# Altium schematic sheet STM8S103F3P6最小系统原理图.SchDoc
size A4
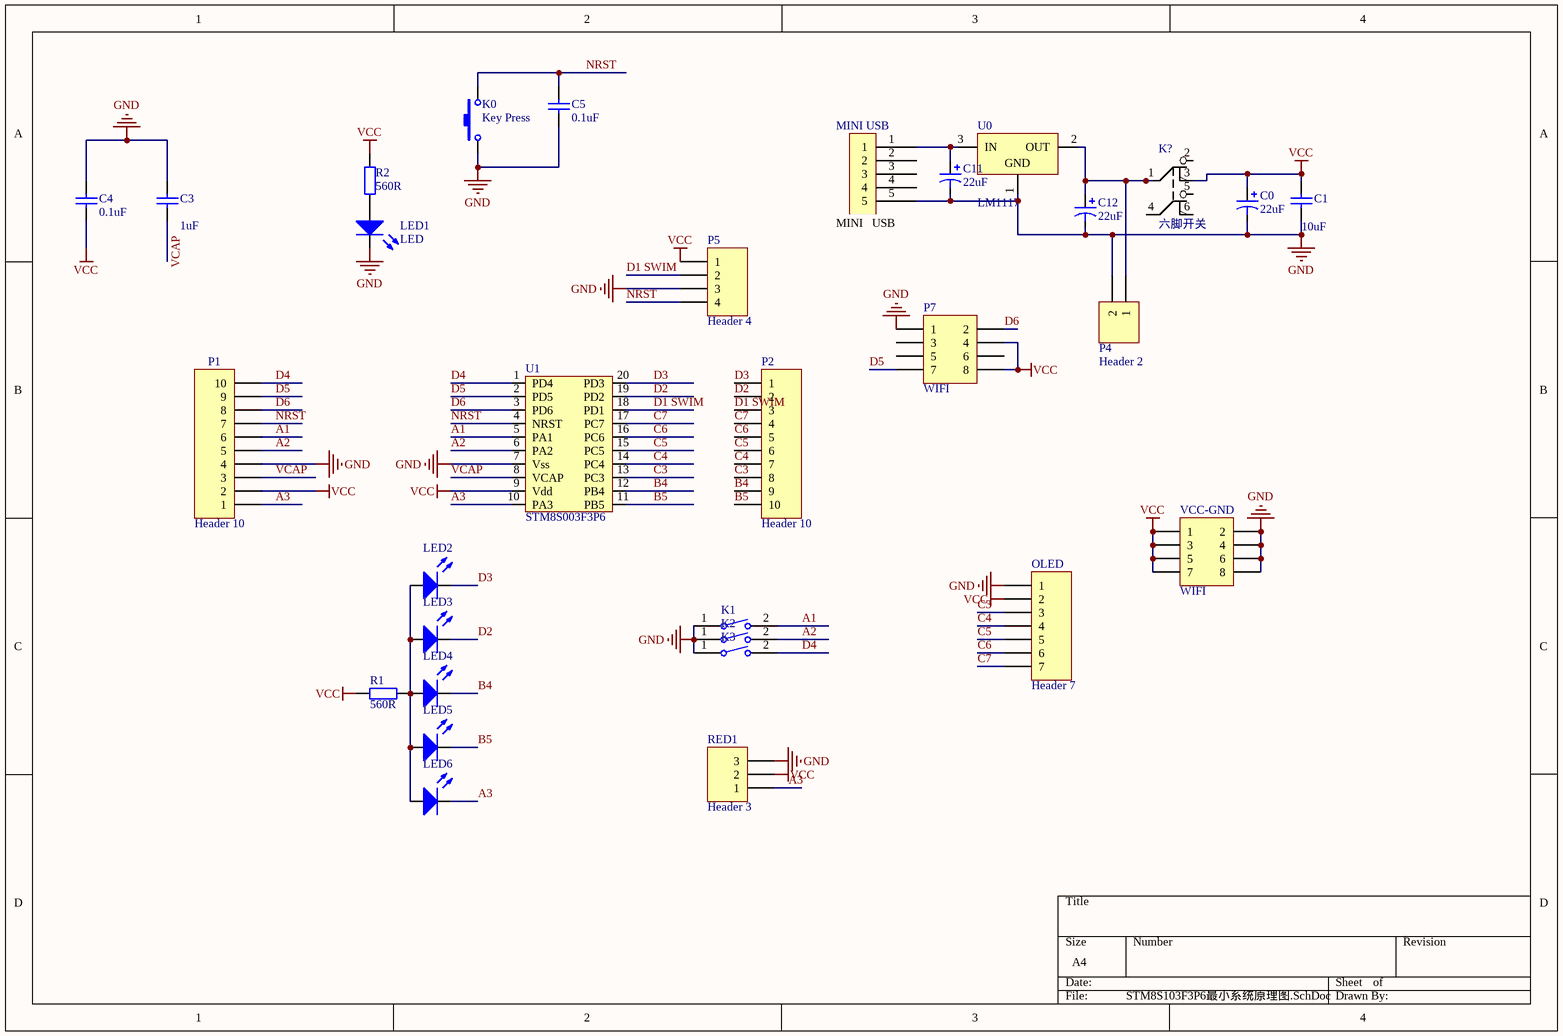
[diagram p0: STM8S103F3P6最小系统原理图.SchDoc]

## Parts
C0  value 22uF  [Pol Cap(220uF)]  (hidden comment: 100uF)
C1  value 10uF  [0805]
C3  value 1uF  [0805]
C4  0.1uF  [0805]
C5  0.1uF  [0805]
C11  value 22uF  [pol cap(10uF)]  (hidden comment: pol cap)
C12  value 22uF  [pol cap(10uF)]  (hidden comment: pol cap)
K0  Key Press  [K_Press]
K1  (no value)  [按键]
K2  (no value)  [按键]
K3  (no value)  [按键]
K?  六脚开关  [按钮开关]
LED1  LED  [LED(0805)]
LED2  (no value)  [LED(0805)]
LED3  (no value)  [LED(0805)]
LED4  (no value)  [LED(0805)]
LED5  (no value)  [LED(0805)]
LED6  (no value)  [LED(0805)]
MINI_USB  (no value)  [MICRO-USB]
OLED  Header 7  [HDR1X7]
P1  Header 10  [HDR1X10]
P2  Header 10  [HDR1X10]
P4  Header 2  [HDR1X2]
P5  Header 4  [HDR1X4]
P7  WIFI  [HDR2X4]
R1  560R  [0805]
R2  560R  [0805]
RED1  Header 3  [HDR1X3]
U0  LM1117  [AMS117]
U1  STM8S003F3P6  [SOP20 - duplicate]
VCC-GND  WIFI  [HDR2X4]

## Nets
GND: C0.2 C1.1 C3.1 C4.1 C5.1 C11.2 C12.2 K0.1 K1.1 K2.1 K3.1 LED1.2(K) MINI_USB.5 OLED.1 P1.4 P4.2 P5.3 P7.1 RED1.3 U0.1(GND) U1.7(Vss) VCC-GND.2 VCC-GND.4 VCC-GND.6 VCC-GND.8
VCC: C0.1 C1.2 C4.2 K?.3 OLED.2 P1.2 P5.1 P7.4 P7.8 R1.1 R2.2 RED1.2 U1.9(Vdd) VCC-GND.1 VCC-GND.3 VCC-GND.5 VCC-GND.7
A1: K1.2 P1.6 U1.5(PA1)
A2: K2.2 P1.5 U1.6(PA2)
A3: LED6.2(K) P1.1 RED1.1 U1.10(PA3)
B4: LED4.2(K) P2.9 U1.12(PB4)
B5: LED5.2(K) P2.10 U1.11(PB5)
C3: OLED.3 P2.8 U1.13(PC3)
C4: OLED.4 P2.7 U1.14(PC4)
C5: OLED.5 P2.6 U1.15(PC5)
C6: OLED.6 P2.5 U1.16(PC6)
C7: OLED.7 P2.4 U1.17(PC7)
D1 SWIM: P2.3 P5.2 U1.18(PD1)
D2: LED3.2(K) P2.2 U1.19(PD2)
D3: LED2.2(K) P2.1 U1.20(PD3)
D4: K3.2 P1.10 U1.1(PD4)
D5: P1.9 P7.7 U1.2(PD5)
D6: P1.8 P7.2 U1.3(PD6)
NRST: C5.2 K0.2 P1.7 P5.4 U1.4(NRST)
VCAP: C3.2 P1.3 U1.8(VCAP)
NetC11_1: C11.1 MINI_USB.1 U0.3(IN)
NetC12_1: C12.1 K?.1 P4.1 U0.2(OUT)
NetLED1_1: LED1.1(A) R2.1
NetLED2_1: LED2.1(A) LED3.1(A) LED4.1(A) LED5.1(A) LED6.1(A) R1.2

Not connected (* = marked no-connect by the designer): K? 2 4 5 6; MINI_USB 2 3 4; P7 3 5 6

## Notes on the sheet
- (in symbol Component_1) MINI   USB

## Library data of the parts
C0 C11 C12 = pol cap: 通用有极电容
C1 C3-C5 = Cap: 无极电容; MADE IN: JMU 智能车制造中心
K0 = K_Press: 贴片按键; MADE IN: JMU 智能车制造中心
K1-K3 = 按键
K? = 六脚开关: 按钮开关; MADE IN: JMU 智能车制造中心
LED1-LED6 = LED: 发光二极管
MINI_USB = Component_1
OLED = Header 7: Header, 7-Pin; LatestRevisionDate: 17-Jul-2002; LatestRevisionNote: Re-released for DXP Platform.; Publisher: Altium Limited
P1 P2 = Header 10: Header, 10-Pin; LatestRevisionDate: 17-Jul-2002; LatestRevisionNote: Re-released for DXP Platform.; Publisher: Altium Limited
P4 = Header 2: Header, 2-Pin; LatestRevisionDate: 17-Jul-2002; LatestRevisionNote: Re-released for DXP Platform.; Publisher: Altium Limited
P5 = Header 4: Header, 4-Pin; LatestRevisionDate: 17-Jul-2002; LatestRevisionNote: Re-released for DXP Platform.; Publisher: Altium Limited
P7 VCC-GND = Header 4X2: Header, 4-Pin, Dual row; LatestRevisionDate: 17-Jul-2002; LatestRevisionNote: Re-released for DXP Platform.; Publisher: Altium Limited
R1 = Res: 通用电阻; Value: 10K
R2 = Res: 通用电阻; Value: 10K; MADE IN: JMU 智能车制造中心
RED1 = Header 3: Header, 3-Pin; LatestRevisionDate: 17-Jul-2002; LatestRevisionNote: Re-released for DXP Platform.; Publisher: Altium Limited